# EAGLE design VehicleDriverSchematic (EAGLE 9.6.2)
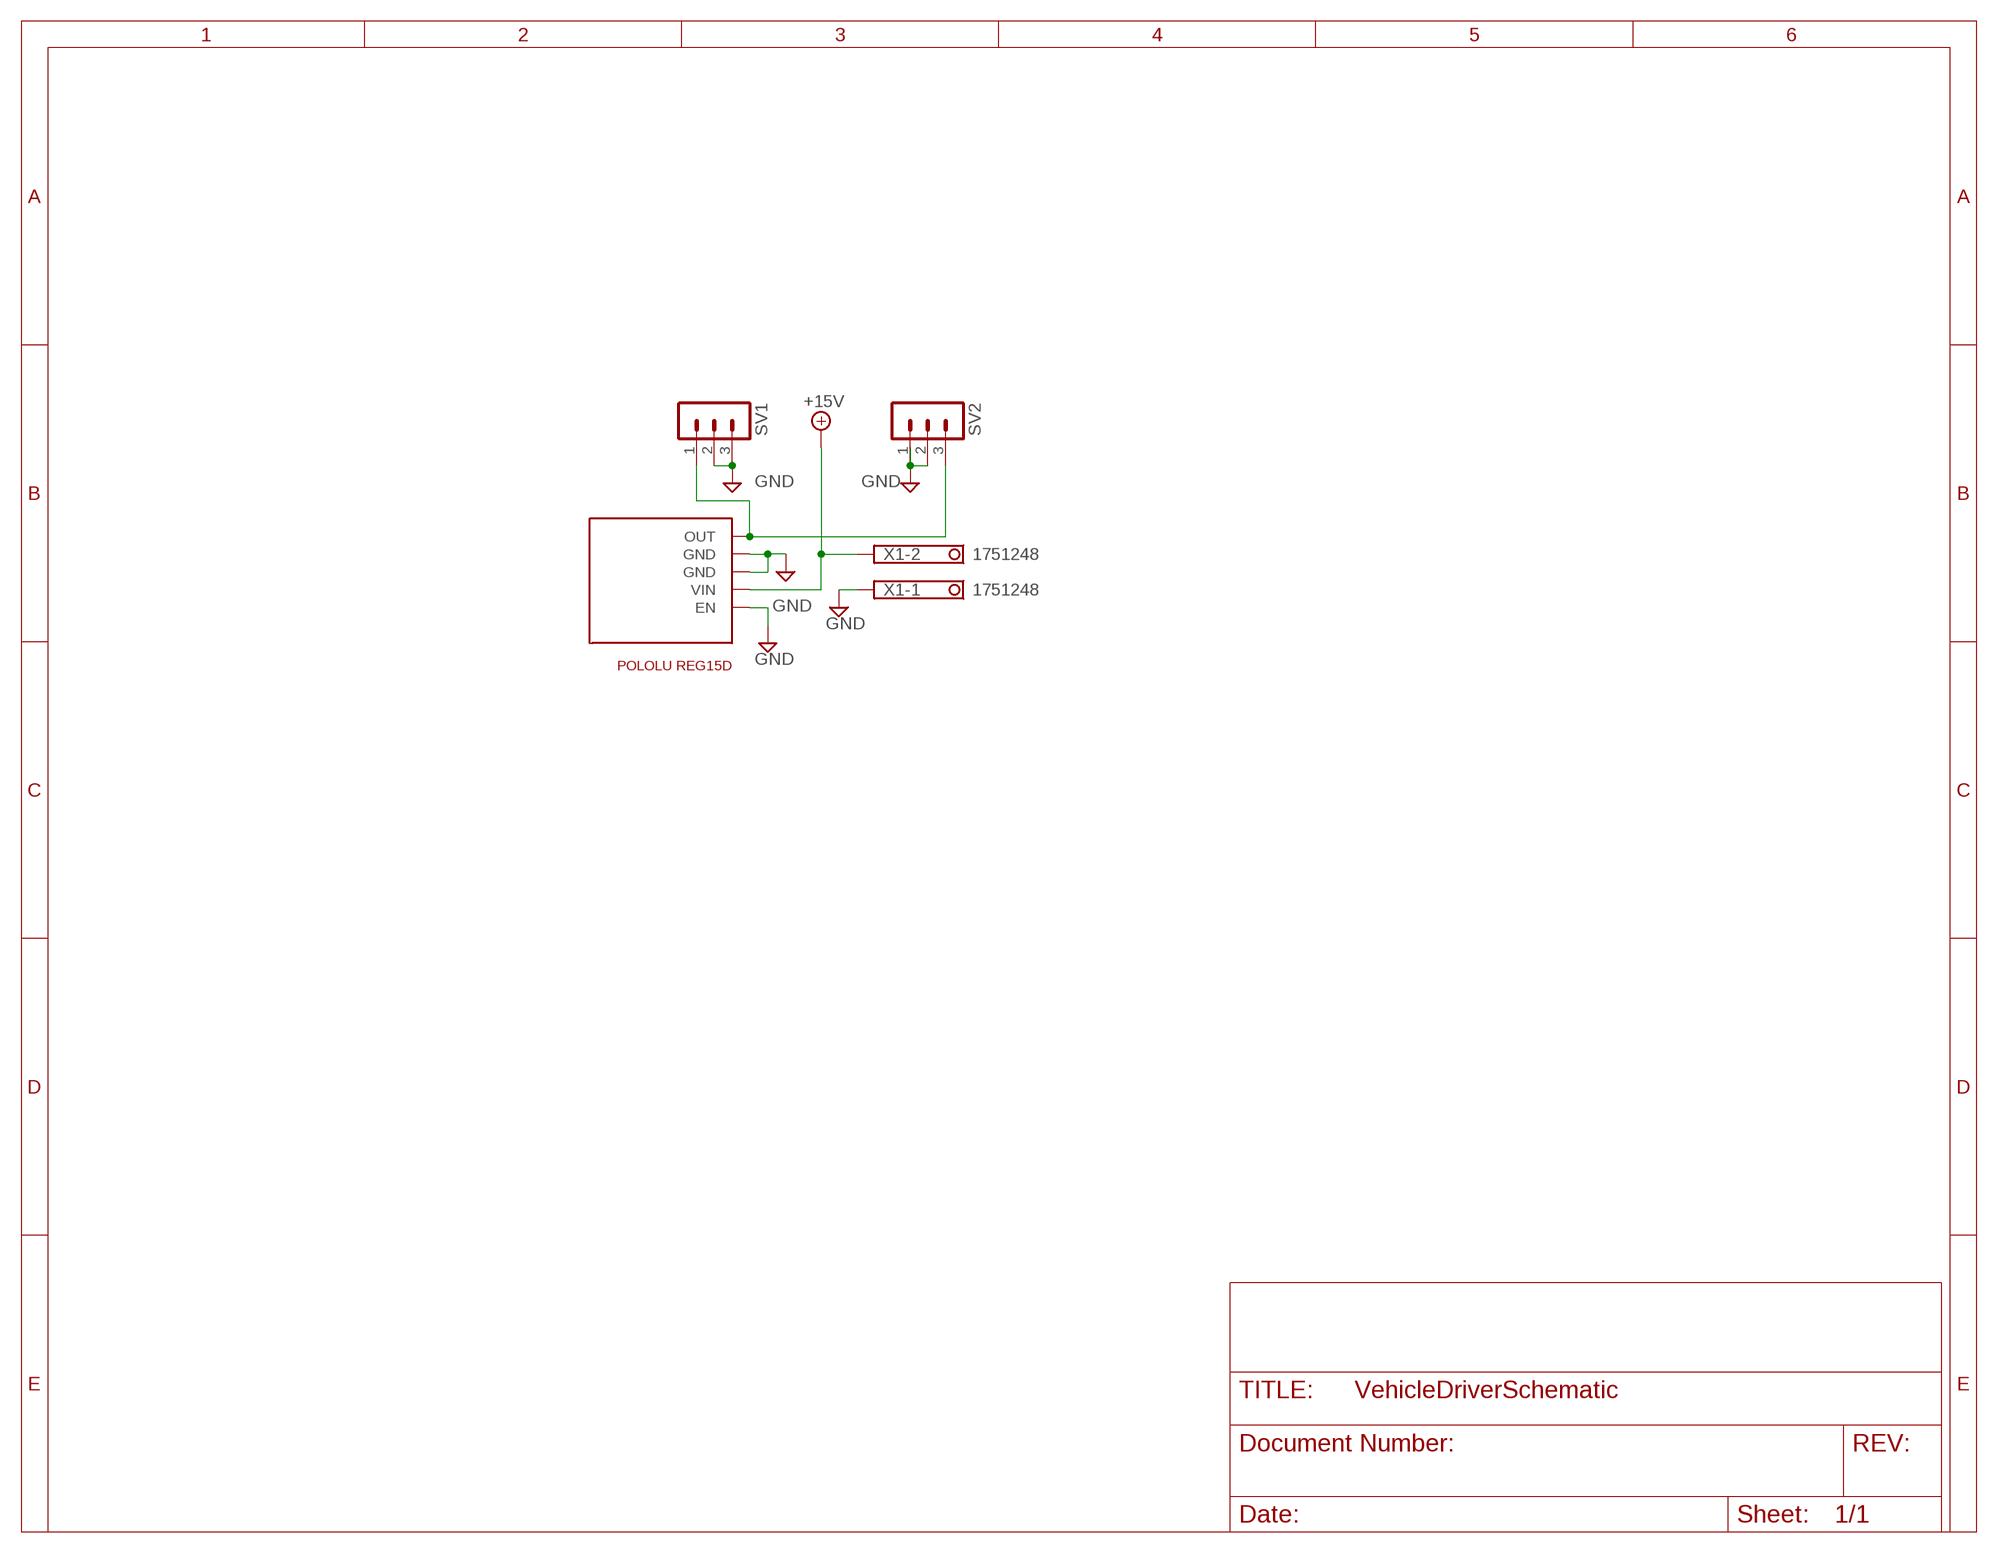
[diagram p0: schematic, sheet 1]

## Parts
SV1  MA03-1  [MA03-1]
SV2  MA03-1  [MA03-1]
U$1  POLOLU_REG15D  [POLOLU_REG15D]
X1  1751248  [1751248]

## Nets
+15V: U$1.VIN X1.2
GND: SV1.2 SV1.3 SV2.1 SV2.2 U$1.EN U$1.GND U$1.GND@1(GND) X1.1
N$1: SV1.1 SV2.3 U$1.OUT

## Library data of the parts
SV1 SV2 = con-lstb:MA03-1: PIN HEADER; OC_FARNELL: unknown; OC_NEWARK: unknown
U$1 = VehicleDriverParts:POLOLU_REG15D
X1 = con-phoenix-350:1751248: MKDS 1/ 2-3,5 Printklemme Nennstrom: 10 A Bemessungsspannung: 160 V Raster: 3,5 mm Polzahl: 2 Montageart: Löten Anschlussart: Schraubanschluss Anschlussrichtung vom Leiter zur Platine: 0° Source: http://eshop.phoenixcontact.com .. 1751248.pdf; OC_FARNELL: unknown; OC_NEWARK: unknown

## Board
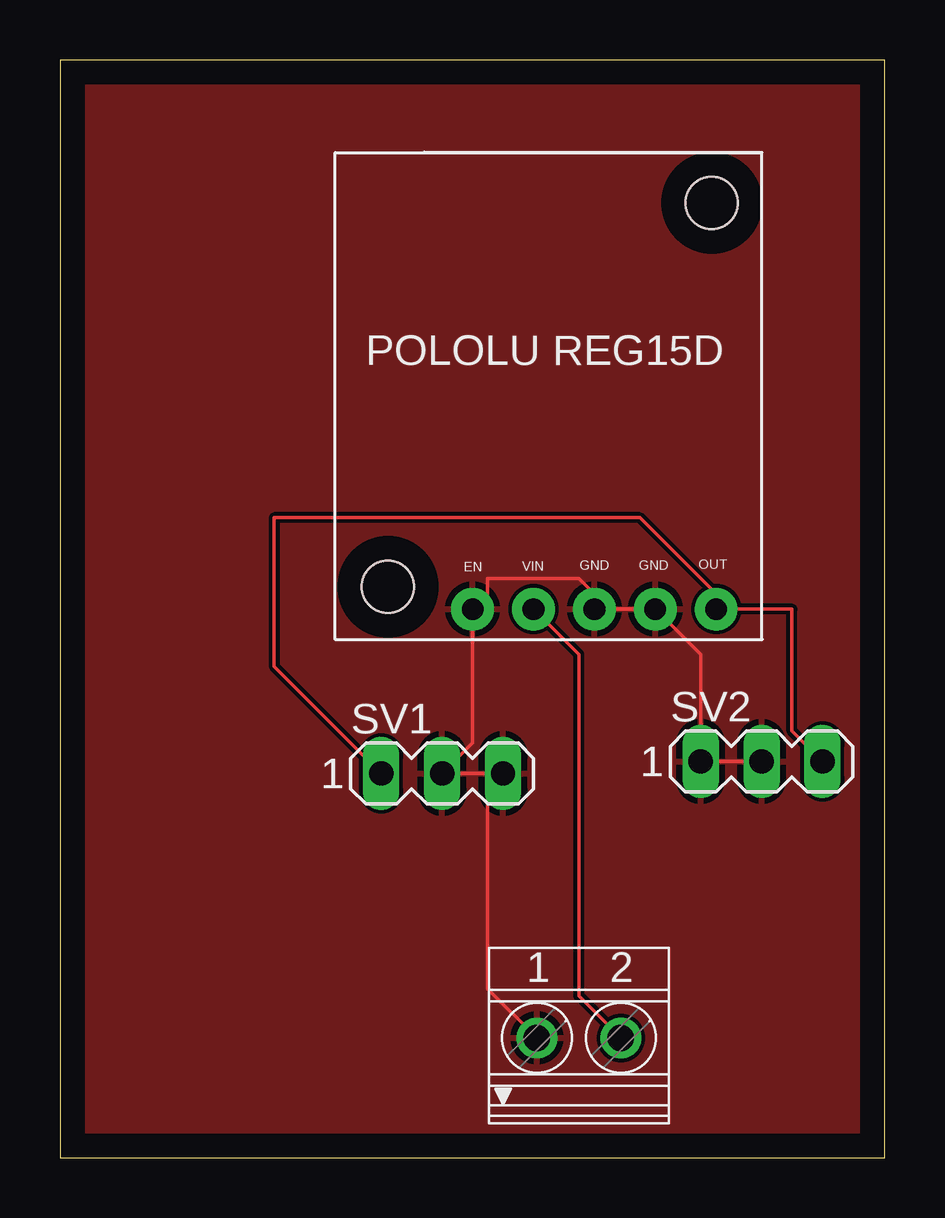
[diagram p1: board, top side]

Size 34.39 x 45.75 mm. Coordinates in mm from the lower left corner, seen from the top.
Outline: 0,0 34.39,0 34.39,45.75 0,45.75 0,0
Copper layers (1*16): Top 0.035mm / dielectric 1.5mm / Bottom 0.035mm
Design rules "default": minimum track width 6mil, minimum drill 0.35mm, track to track 6mil, track to pad 6mil, pad to pad 6mil, via to via 6mil, smd to smd 6mil, copper to edge 40mil, drill to drill 6mil, minimum pad ring 10mil, minimum via ring 8mil, stop-mask expansion 4mil, vias tented up to drill 0mil, thermal gap 10mil

### Footprints (pad centres in the part's own frame; a part is rotated, then mirrored left to right if it is on the bottom)
MA03-1 = drill 1.016 long: 1 -2.54,0; 2 0,0; 3 2.54,0
POLOLU_REG15D = drill 0.9 pad 1.778: EN 5.73,1.27; GND 13.35,1.27; GND@1 10.81,1.27; OUT 15.89,1.27; VIN 8.27,1.27 | hole 2.18: 2.2,2.2; 15.7,18.2
1751248 = drill 1.1 pad 1.7: 1 -1.75,-0.1; 2 1.75,-0.1

### Placement (x,y rotation side)
SV1  15.93,16.01 0 top
SV2  29.25,16.51 0 top
U$1  11.47,21.59 0 top
X1  21.63,5.08 0 top

### Tracks (layer width: path | path; a pad name or v marks a point on that pad's centre or on a via)
+15V
  Top 0.152: X1.2 21.63,6.73 21.63,20.97 U$1.VIN
GND
  Top 0.152: SV2.2 SV2.1 26.71,20.97 U$1.GND U$1.GND@1 22.28,23.48 21.63,24.13 17.82,24.13 17.82,23.48 U$1.EN 17.2,17.28 SV1.2 SV1.3 17.82,15.36 17.82,7.04 X1.1
  pour Top: 0,45.75 0,0 34.39,0 34.39,45.75
N$1
  Top 0.152: SV2.3 30.52,17.78 30.52,22.86 U$1.OUT 27.36,23.48 24.17,26.67 8.93,26.67 8.93,20.47 SV1.1